# Vivado block design bd_1f3d, xcu200-fsgd2104-2-e, Vivado 2020.1
# (continued, part 4 of 5)
current_bd_instance /m09_exit_pipeline

create_bd_cell -type ip -vlnv xilinx.com:ip:sc_exit:1.0 m09_exit
set_property -dict [list \
  CONFIG.ADDR_WIDTH 9 \
  CONFIG.ENABLE_PIPELINING 0 \
  CONFIG.HAS_BURST 0 \
  CONFIG.IS_CASCADED 0 \
  CONFIG.MEP_IDENTIFIER_WIDTH 1 \
  CONFIG.M_MAX_BURST_LENGTH 0 \
  CONFIG.M_PROTOCOL AXI4LITE \
  CONFIG.NUM_MSC 11 \
  CONFIG.NUM_READ_OUTSTANDING 1 \
  CONFIG.NUM_WRITE_OUTSTANDING 1 \
  CONFIG.RDATA_WIDTH 32 \
  CONFIG.READ_WRITE_MODE READ_WRITE \
  CONFIG.SINGLE_ISSUING 1 \
  CONFIG.SSC000_ROUTE 0b111 \
  CONFIG.SSC001_ROUTE 0b101 \
  CONFIG.SSC_ROUTE_WIDTH 3 \
  CONFIG.S_ID_WIDTH 1 \
  CONFIG.WDATA_WIDTH 32 \
] [get_bd_cells m09_exit]

# ---- hierarchy /m10_nodes ----
current_bd_instance /m10_nodes
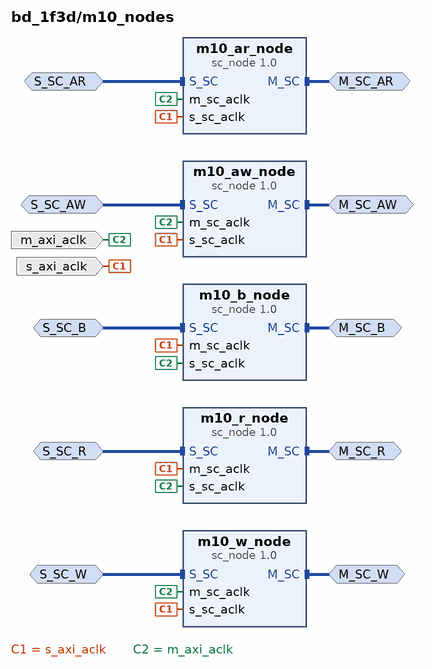
[diagram p25: block diagram inside /m10_nodes]
create_bd_intf_pin -mode Master -vlnv xilinx.com:interface:sc_rtl:1.0 M_SC_AR
create_bd_intf_pin -mode Slave -vlnv xilinx.com:interface:sc_rtl:1.0 S_SC_AR
create_bd_intf_pin -mode Master -vlnv xilinx.com:interface:sc_rtl:1.0 M_SC_R
create_bd_intf_pin -mode Slave -vlnv xilinx.com:interface:sc_rtl:1.0 S_SC_R
create_bd_intf_pin -mode Master -vlnv xilinx.com:interface:sc_rtl:1.0 M_SC_AW
create_bd_intf_pin -mode Slave -vlnv xilinx.com:interface:sc_rtl:1.0 S_SC_AW
create_bd_intf_pin -mode Master -vlnv xilinx.com:interface:sc_rtl:1.0 M_SC_W
create_bd_intf_pin -mode Slave -vlnv xilinx.com:interface:sc_rtl:1.0 S_SC_W
create_bd_intf_pin -mode Master -vlnv xilinx.com:interface:sc_rtl:1.0 M_SC_B
create_bd_intf_pin -mode Slave -vlnv xilinx.com:interface:sc_rtl:1.0 S_SC_B
create_bd_pin -dir I -type clk s_axi_aclk
create_bd_pin -dir I -type clk m_axi_aclk

create_bd_cell -type ip -vlnv xilinx.com:ip:sc_node:1.0 m10_ar_node
set_property -dict [list \
  CONFIG.ACLK_RELATIONSHIP 0 \
  CONFIG.ADDR_WIDTH 32 \
  CONFIG.CHANNEL 2 \
  CONFIG.FIFO_SIZE 0 \
  CONFIG.FIFO_TYPE 0 \
  CONFIG.ID_WIDTH 1 \
  CONFIG.M00_NUM_BYTES 4 \
  CONFIG.M01_NUM_BYTES 4 \
  CONFIG.M02_NUM_BYTES 4 \
  CONFIG.M03_NUM_BYTES 4 \
  CONFIG.M04_NUM_BYTES 4 \
  CONFIG.M05_NUM_BYTES 4 \
  CONFIG.M06_NUM_BYTES 4 \
  CONFIG.M07_NUM_BYTES 4 \
  CONFIG.M08_NUM_BYTES 4 \
  CONFIG.M09_NUM_BYTES 4 \
  CONFIG.M10_NUM_BYTES 4 \
  CONFIG.M11_NUM_BYTES 4 \
  CONFIG.M12_NUM_BYTES 4 \
  CONFIG.M13_NUM_BYTES 4 \
  CONFIG.M14_NUM_BYTES 4 \
  CONFIG.M15_NUM_BYTES 4 \
  CONFIG.MAX_PAYLD_BYTES 4 \
  CONFIG.M_SEND_PIPELINE 0 \
  CONFIG.NUM_MI 1 \
  CONFIG.NUM_OUTSTANDING 1 \
  CONFIG.NUM_SI 1 \
  CONFIG.PAYLD_WIDTH 150 \
  CONFIG.S00_NUM_BYTES 4 \
  CONFIG.S01_NUM_BYTES 4 \
  CONFIG.S02_NUM_BYTES 4 \
  CONFIG.S03_NUM_BYTES 4 \
  CONFIG.S04_NUM_BYTES 4 \
  CONFIG.S05_NUM_BYTES 4 \
  CONFIG.S06_NUM_BYTES 4 \
  CONFIG.S07_NUM_BYTES 4 \
  CONFIG.S08_NUM_BYTES 4 \
  CONFIG.S09_NUM_BYTES 4 \
  CONFIG.S10_NUM_BYTES 4 \
  CONFIG.S11_NUM_BYTES 4 \
  CONFIG.S12_NUM_BYTES 4 \
  CONFIG.S13_NUM_BYTES 4 \
  CONFIG.S14_NUM_BYTES 4 \
  CONFIG.S15_NUM_BYTES 4 \
  CONFIG.SC_ROUTE_WIDTH 13 \
  CONFIG.USER_WIDTH 0 \
] [get_bd_cells m10_ar_node]
create_bd_cell -type ip -vlnv xilinx.com:ip:sc_node:1.0 m10_r_node
set_property -dict [list \
  CONFIG.ACLK_RELATIONSHIP 0 \
  CONFIG.ADDR_WIDTH 32 \
  CONFIG.CHANNEL 0 \
  CONFIG.FIFO_SIZE 0 \
  CONFIG.FIFO_TYPE 0 \
  CONFIG.ID_WIDTH 1 \
  CONFIG.M00_NUM_BYTES 4 \
  CONFIG.M01_NUM_BYTES 4 \
  CONFIG.M02_NUM_BYTES 4 \
  CONFIG.M03_NUM_BYTES 4 \
  CONFIG.M04_NUM_BYTES 4 \
  CONFIG.M05_NUM_BYTES 4 \
  CONFIG.M06_NUM_BYTES 4 \
  CONFIG.M07_NUM_BYTES 4 \
  CONFIG.M08_NUM_BYTES 4 \
  CONFIG.M09_NUM_BYTES 4 \
  CONFIG.M10_NUM_BYTES 4 \
  CONFIG.M11_NUM_BYTES 4 \
  CONFIG.M12_NUM_BYTES 4 \
  CONFIG.M13_NUM_BYTES 4 \
  CONFIG.M14_NUM_BYTES 4 \
  CONFIG.M15_NUM_BYTES 4 \
  CONFIG.MAX_PAYLD_BYTES 4 \
  CONFIG.NUM_MI 1 \
  CONFIG.NUM_OUTSTANDING 1 \
  CONFIG.NUM_SI 1 \
  CONFIG.PAYLD_WIDTH 53 \
  CONFIG.S00_NUM_BYTES 4 \
  CONFIG.S01_NUM_BYTES 4 \
  CONFIG.S02_NUM_BYTES 4 \
  CONFIG.S03_NUM_BYTES 4 \
  CONFIG.S04_NUM_BYTES 4 \
  CONFIG.S05_NUM_BYTES 4 \
  CONFIG.S06_NUM_BYTES 4 \
  CONFIG.S07_NUM_BYTES 4 \
  CONFIG.S08_NUM_BYTES 4 \
  CONFIG.S09_NUM_BYTES 4 \
  CONFIG.S10_NUM_BYTES 4 \
  CONFIG.S11_NUM_BYTES 4 \
  CONFIG.S12_NUM_BYTES 4 \
  CONFIG.S13_NUM_BYTES 4 \
  CONFIG.S14_NUM_BYTES 4 \
  CONFIG.S15_NUM_BYTES 4 \
  CONFIG.SC_ROUTE_WIDTH 3 \
  CONFIG.USER_BITS_PER_BYTE 0 \
  CONFIG.USER_WIDTH 0 \
] [get_bd_cells m10_r_node]
create_bd_cell -type ip -vlnv xilinx.com:ip:sc_node:1.0 m10_aw_node
set_property -dict [list \
  CONFIG.ACLK_RELATIONSHIP 0 \
  CONFIG.ADDR_WIDTH 32 \
  CONFIG.CHANNEL 3 \
  CONFIG.FIFO_SIZE 0 \
  CONFIG.FIFO_TYPE 0 \
  CONFIG.ID_WIDTH 1 \
  CONFIG.M00_NUM_BYTES 4 \
  CONFIG.M01_NUM_BYTES 4 \
  CONFIG.M02_NUM_BYTES 4 \
  CONFIG.M03_NUM_BYTES 4 \
  CONFIG.M04_NUM_BYTES 4 \
  CONFIG.M05_NUM_BYTES 4 \
  CONFIG.M06_NUM_BYTES 4 \
  CONFIG.M07_NUM_BYTES 4 \
  CONFIG.M08_NUM_BYTES 4 \
  CONFIG.M09_NUM_BYTES 4 \
  CONFIG.M10_NUM_BYTES 4 \
  CONFIG.M11_NUM_BYTES 4 \
  CONFIG.M12_NUM_BYTES 4 \
  CONFIG.M13_NUM_BYTES 4 \
  CONFIG.M14_NUM_BYTES 4 \
  CONFIG.M15_NUM_BYTES 4 \
  CONFIG.MAX_PAYLD_BYTES 4 \
  CONFIG.M_SEND_PIPELINE 0 \
  CONFIG.NUM_MI 1 \
  CONFIG.NUM_OUTSTANDING 1 \
  CONFIG.NUM_SI 1 \
  CONFIG.PAYLD_WIDTH 150 \
  CONFIG.S00_NUM_BYTES 4 \
  CONFIG.S01_NUM_BYTES 4 \
  CONFIG.S02_NUM_BYTES 4 \
  CONFIG.S03_NUM_BYTES 4 \
  CONFIG.S04_NUM_BYTES 4 \
  CONFIG.S05_NUM_BYTES 4 \
  CONFIG.S06_NUM_BYTES 4 \
  CONFIG.S07_NUM_BYTES 4 \
  CONFIG.S08_NUM_BYTES 4 \
  CONFIG.S09_NUM_BYTES 4 \
  CONFIG.S10_NUM_BYTES 4 \
  CONFIG.S11_NUM_BYTES 4 \
  CONFIG.S12_NUM_BYTES 4 \
  CONFIG.S13_NUM_BYTES 4 \
  CONFIG.S14_NUM_BYTES 4 \
  CONFIG.S15_NUM_BYTES 4 \
  CONFIG.SC_ROUTE_WIDTH 13 \
  CONFIG.USER_WIDTH 0 \
] [get_bd_cells m10_aw_node]
create_bd_cell -type ip -vlnv xilinx.com:ip:sc_node:1.0 m10_w_node
set_property -dict [list \
  CONFIG.ACLK_RELATIONSHIP 0 \
  CONFIG.ADDR_WIDTH 32 \
  CONFIG.CHANNEL 1 \
  CONFIG.FIFO_SIZE 0 \
  CONFIG.FIFO_TYPE 0 \
  CONFIG.ID_WIDTH 1 \
  CONFIG.M00_NUM_BYTES 4 \
  CONFIG.M01_NUM_BYTES 4 \
  CONFIG.M02_NUM_BYTES 4 \
  CONFIG.M03_NUM_BYTES 4 \
  CONFIG.M04_NUM_BYTES 4 \
  CONFIG.M05_NUM_BYTES 4 \
  CONFIG.M06_NUM_BYTES 4 \
  CONFIG.M07_NUM_BYTES 4 \
  CONFIG.M08_NUM_BYTES 4 \
  CONFIG.M09_NUM_BYTES 4 \
  CONFIG.M10_NUM_BYTES 4 \
  CONFIG.M11_NUM_BYTES 4 \
  CONFIG.M12_NUM_BYTES 4 \
  CONFIG.M13_NUM_BYTES 4 \
  CONFIG.M14_NUM_BYTES 4 \
  CONFIG.M15_NUM_BYTES 4 \
  CONFIG.MAX_PAYLD_BYTES 4 \
  CONFIG.M_SEND_PIPELINE 0 \
  CONFIG.NUM_MI 1 \
  CONFIG.NUM_OUTSTANDING 1 \
  CONFIG.NUM_SI 1 \
  CONFIG.PAYLD_WIDTH 64 \
  CONFIG.S00_NUM_BYTES 4 \
  CONFIG.S01_NUM_BYTES 4 \
  CONFIG.S02_NUM_BYTES 4 \
  CONFIG.S03_NUM_BYTES 4 \
  CONFIG.S04_NUM_BYTES 4 \
  CONFIG.S05_NUM_BYTES 4 \
  CONFIG.S06_NUM_BYTES 4 \
  CONFIG.S07_NUM_BYTES 4 \
  CONFIG.S08_NUM_BYTES 4 \
  CONFIG.S09_NUM_BYTES 4 \
  CONFIG.S10_NUM_BYTES 4 \
  CONFIG.S11_NUM_BYTES 4 \
  CONFIG.S12_NUM_BYTES 4 \
  CONFIG.S13_NUM_BYTES 4 \
  CONFIG.S14_NUM_BYTES 4 \
  CONFIG.S15_NUM_BYTES 4 \
  CONFIG.SC_ROUTE_WIDTH 13 \
  CONFIG.USER_BITS_PER_BYTE 0 \
  CONFIG.USER_WIDTH 0 \
] [get_bd_cells m10_w_node]
create_bd_cell -type ip -vlnv xilinx.com:ip:sc_node:1.0 m10_b_node
set_property -dict [list \
  CONFIG.ACLK_RELATIONSHIP 0 \
  CONFIG.ADDR_WIDTH 32 \
  CONFIG.CHANNEL 4 \
  CONFIG.FIFO_SIZE 0 \
  CONFIG.FIFO_TYPE 0 \
  CONFIG.ID_WIDTH 1 \
  CONFIG.M00_NUM_BYTES 4 \
  CONFIG.M01_NUM_BYTES 4 \
  CONFIG.M02_NUM_BYTES 4 \
  CONFIG.M03_NUM_BYTES 4 \
  CONFIG.M04_NUM_BYTES 4 \
  CONFIG.M05_NUM_BYTES 4 \
  CONFIG.M06_NUM_BYTES 4 \
  CONFIG.M07_NUM_BYTES 4 \
  CONFIG.M08_NUM_BYTES 4 \
  CONFIG.M09_NUM_BYTES 4 \
  CONFIG.M10_NUM_BYTES 4 \
  CONFIG.M11_NUM_BYTES 4 \
  CONFIG.M12_NUM_BYTES 4 \
  CONFIG.M13_NUM_BYTES 4 \
  CONFIG.M14_NUM_BYTES 4 \
  CONFIG.M15_NUM_BYTES 4 \
  CONFIG.MAX_PAYLD_BYTES 4 \
  CONFIG.NUM_MI 1 \
  CONFIG.NUM_OUTSTANDING 1 \
  CONFIG.NUM_SI 1 \
  CONFIG.PAYLD_WIDTH 7 \
  CONFIG.S00_NUM_BYTES 4 \
  CONFIG.S01_NUM_BYTES 4 \
  CONFIG.S02_NUM_BYTES 4 \
  CONFIG.S03_NUM_BYTES 4 \
  CONFIG.S04_NUM_BYTES 4 \
  CONFIG.S05_NUM_BYTES 4 \
  CONFIG.S06_NUM_BYTES 4 \
  CONFIG.S07_NUM_BYTES 4 \
  CONFIG.S08_NUM_BYTES 4 \
  CONFIG.S09_NUM_BYTES 4 \
  CONFIG.S10_NUM_BYTES 4 \
  CONFIG.S11_NUM_BYTES 4 \
  CONFIG.S12_NUM_BYTES 4 \
  CONFIG.S13_NUM_BYTES 4 \
  CONFIG.S14_NUM_BYTES 4 \
  CONFIG.S15_NUM_BYTES 4 \
  CONFIG.SC_ROUTE_WIDTH 3 \
  CONFIG.USER_WIDTH 0 \
] [get_bd_cells m10_b_node]

# ---- hierarchy /m10_exit_pipeline ----
current_bd_instance /m10_exit_pipeline
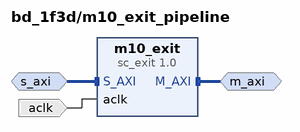
[diagram p26: block diagram inside /m10_exit_pipeline]
create_bd_intf_pin -mode Slave -vlnv xilinx.com:interface:aximm_rtl:1.0 s_axi
create_bd_intf_pin -mode Master -vlnv xilinx.com:interface:aximm_rtl:1.0 m_axi
create_bd_pin -dir I -type clk aclk

create_bd_cell -type ip -vlnv xilinx.com:ip:sc_exit:1.0 m10_exit
set_property -dict [list \
  CONFIG.ADDR_WIDTH 9 \
  CONFIG.ENABLE_PIPELINING 0 \
  CONFIG.HAS_BURST 0 \
  CONFIG.IS_CASCADED 0 \
  CONFIG.MEP_IDENTIFIER_WIDTH 1 \
  CONFIG.M_MAX_BURST_LENGTH 0 \
  CONFIG.M_PROTOCOL AXI4LITE \
  CONFIG.NUM_MSC 11 \
  CONFIG.NUM_READ_OUTSTANDING 1 \
  CONFIG.NUM_WRITE_OUTSTANDING 1 \
  CONFIG.RDATA_WIDTH 32 \
  CONFIG.READ_WRITE_MODE READ_WRITE \
  CONFIG.SINGLE_ISSUING 1 \
  CONFIG.SSC000_ROUTE 0b111 \
  CONFIG.SSC001_ROUTE 0b101 \
  CONFIG.SSC_ROUTE_WIDTH 3 \
  CONFIG.S_ID_WIDTH 1 \
  CONFIG.WDATA_WIDTH 32 \
] [get_bd_cells m10_exit]

# ---- connections ----

current_bd_instance /clk_map
connect_bd_net -net clk_map_aclk1_net [get_bd_pins aclk1] \
  [get_bd_pins M01_ACLK] [get_bd_pins M02_ACLK] [get_bd_pins M03_ACLK] [get_bd_pins M04_ACLK] [get_bd_pins M05_ACLK] \
  [get_bd_pins M06_ACLK] [get_bd_pins M07_ACLK] [get_bd_pins M08_ACLK] [get_bd_pins M09_ACLK] [get_bd_pins M10_ACLK]
connect_bd_net -net clk_map_aclk_net [get_bd_pins aclk] [get_bd_pins S00_ACLK] [get_bd_pins M00_ACLK] [get_bd_pins swbd_aclk]

current_bd_instance /switchboards
connect_bd_intf_net [get_bd_intf_pins M00_SC_AW] [get_bd_intf_pins aw_la_out_swbd/M00_SC]
connect_bd_intf_net [get_bd_intf_pins S00_SC_AW] [get_bd_intf_pins aw_la_in_swbd/S00_SC]
connect_bd_intf_net [get_bd_intf_pins S00_SC_AR] [get_bd_intf_pins ar_la_in_swbd/S00_SC]
connect_bd_intf_net [get_bd_intf_pins M00_SC_B] [get_bd_intf_pins b_la_in_swbd/M00_SC]
connect_bd_intf_net [get_bd_intf_pins M00_SC_R] [get_bd_intf_pins r_la_in_swbd/M00_SC]
connect_bd_intf_net [get_bd_intf_pins M00_SC_AR] [get_bd_intf_pins ar_la_out_swbd/M00_SC]
connect_bd_intf_net [get_bd_intf_pins S00_SC_W] [get_bd_intf_pins w_la_in_swbd/S00_SC]
connect_bd_intf_net [get_bd_intf_pins S03_SC_R] [get_bd_intf_pins r_la_out_swbd/S03_SC]
connect_bd_intf_net [get_bd_intf_pins S02_SC_R] [get_bd_intf_pins r_la_out_swbd/S02_SC]
connect_bd_intf_net [get_bd_intf_pins S06_SC_B] [get_bd_intf_pins b_la_out_swbd/S06_SC]
connect_bd_intf_net [get_bd_intf_pins S10_SC_B] [get_bd_intf_pins b_la_out_swbd/S10_SC]
connect_bd_intf_net [get_bd_intf_pins S09_SC_B] [get_bd_intf_pins b_la_out_swbd/S09_SC]
connect_bd_intf_net [get_bd_intf_pins S08_SC_B] [get_bd_intf_pins b_la_out_swbd/S08_SC]
connect_bd_intf_net [get_bd_intf_pins S07_SC_B] [get_bd_intf_pins b_la_out_swbd/S07_SC]
connect_bd_intf_net [get_bd_intf_pins M07_SC_AW] [get_bd_intf_pins aw_la_out_swbd/M07_SC]
connect_bd_intf_net [get_bd_intf_pins M05_SC_AW] [get_bd_intf_pins aw_la_out_swbd/M05_SC]
connect_bd_intf_net [get_bd_intf_pins M06_SC_AW] [get_bd_intf_pins aw_la_out_swbd/M06_SC]
connect_bd_intf_net [get_bd_intf_pins M04_SC_AW] [get_bd_intf_pins aw_la_out_swbd/M04_SC]
connect_bd_intf_net [get_bd_intf_pins M03_SC_AW] [get_bd_intf_pins aw_la_out_swbd/M03_SC]
connect_bd_intf_net [get_bd_intf_pins S05_SC_B] [get_bd_intf_pins b_la_out_swbd/S05_SC]
connect_bd_intf_net [get_bd_intf_pins S04_SC_B] [get_bd_intf_pins b_la_out_swbd/S04_SC]
connect_bd_intf_net [get_bd_intf_pins S03_SC_B] [get_bd_intf_pins b_la_out_swbd/S03_SC]
connect_bd_intf_net [get_bd_intf_pins S02_SC_B] [get_bd_intf_pins b_la_out_swbd/S02_SC]
connect_bd_intf_net [get_bd_intf_pins S01_SC_B] [get_bd_intf_pins b_la_out_swbd/S01_SC]
connect_bd_intf_net [get_bd_intf_pins S00_SC_B] [get_bd_intf_pins b_la_out_swbd/S00_SC]
connect_bd_intf_net [get_bd_intf_pins M10_SC_AW] [get_bd_intf_pins aw_la_out_swbd/M10_SC]
connect_bd_intf_net [get_bd_intf_pins M09_SC_AW] [get_bd_intf_pins aw_la_out_swbd/M09_SC]
connect_bd_intf_net [get_bd_intf_pins M08_SC_AW] [get_bd_intf_pins aw_la_out_swbd/M08_SC]
connect_bd_intf_net [get_bd_intf_pins M10_SC_AR] [get_bd_intf_pins ar_la_out_swbd/M10_SC]
connect_bd_intf_net [get_bd_intf_pins M09_SC_AR] [get_bd_intf_pins ar_la_out_swbd/M09_SC]
connect_bd_intf_net [get_bd_intf_pins M08_SC_AR] [get_bd_intf_pins ar_la_out_swbd/M08_SC]
connect_bd_intf_net [get_bd_intf_pins M07_SC_AR] [get_bd_intf_pins ar_la_out_swbd/M07_SC]
connect_bd_intf_net [get_bd_intf_pins M06_SC_AR] [get_bd_intf_pins ar_la_out_swbd/M06_SC]
connect_bd_intf_net [get_bd_intf_pins M05_SC_AR] [get_bd_intf_pins ar_la_out_swbd/M05_SC]
connect_bd_intf_net [get_bd_intf_pins M04_SC_AR] [get_bd_intf_pins ar_la_out_swbd/M04_SC]
connect_bd_intf_net [get_bd_intf_pins M03_SC_AR] [get_bd_intf_pins ar_la_out_swbd/M03_SC]
connect_bd_intf_net [get_bd_intf_pins M02_SC_AR] [get_bd_intf_pins ar_la_out_swbd/M02_SC]
connect_bd_intf_net [get_bd_intf_pins M02_SC_AW] [get_bd_intf_pins aw_la_out_swbd/M02_SC]
connect_bd_intf_net [get_bd_intf_pins M01_SC_AW] [get_bd_intf_pins aw_la_out_swbd/M01_SC]
connect_bd_intf_net [get_bd_intf_pins M01_SC_AR] [get_bd_intf_pins ar_la_out_swbd/M01_SC]
connect_bd_intf_net [get_bd_intf_pins r_la_in_swbd/S00_SC] [get_bd_intf_pins i_nodes/M_SC_R]
connect_bd_intf_net [get_bd_intf_pins ar_la_out_swbd/S00_SC] [get_bd_intf_pins i_nodes/M_SC_AR]
connect_bd_intf_net [get_bd_intf_pins b_la_in_swbd/S00_SC] [get_bd_intf_pins i_nodes/M_SC_B]
connect_bd_intf_net [get_bd_intf_pins aw_la_in_swbd/M00_SC] [get_bd_intf_pins i_nodes/S_SC_AW]
connect_bd_intf_net [get_bd_intf_pins w_la_in_swbd/M00_SC] [get_bd_intf_pins i_nodes/S_SC_W]
connect_bd_intf_net [get_bd_intf_pins ar_la_in_swbd/M00_SC] [get_bd_intf_pins i_nodes/S_SC_AR]
connect_bd_intf_net [get_bd_intf_pins M10_SC_W] [get_bd_intf_pins w_la_out_swbd/M10_SC]
connect_bd_intf_net [get_bd_intf_pins b_la_out_swbd/M00_SC] [get_bd_intf_pins i_nodes/S_SC_B]
connect_bd_intf_net [get_bd_intf_pins r_la_out_swbd/M00_SC] [get_bd_intf_pins i_nodes/S_SC_R]
connect_bd_intf_net [get_bd_intf_pins w_la_out_swbd/S00_SC] [get_bd_intf_pins i_nodes/M_SC_W]
connect_bd_intf_net [get_bd_intf_pins aw_la_out_swbd/S00_SC] [get_bd_intf_pins i_nodes/M_SC_AW]
connect_bd_intf_net [get_bd_intf_pins M05_SC_W] [get_bd_intf_pins w_la_out_swbd/M05_SC]
connect_bd_intf_net [get_bd_intf_pins M06_SC_W] [get_bd_intf_pins w_la_out_swbd/M06_SC]
connect_bd_intf_net [get_bd_intf_pins M04_SC_W] [get_bd_intf_pins w_la_out_swbd/M04_SC]
connect_bd_intf_net [get_bd_intf_pins M03_SC_W] [get_bd_intf_pins w_la_out_swbd/M03_SC]
connect_bd_intf_net [get_bd_intf_pins M09_SC_W] [get_bd_intf_pins w_la_out_swbd/M09_SC]
connect_bd_intf_net [get_bd_intf_pins M08_SC_W] [get_bd_intf_pins w_la_out_swbd/M08_SC]
connect_bd_intf_net [get_bd_intf_pins M07_SC_W] [get_bd_intf_pins w_la_out_swbd/M07_SC]
connect_bd_intf_net [get_bd_intf_pins S09_SC_R] [get_bd_intf_pins r_la_out_swbd/S09_SC]
connect_bd_intf_net [get_bd_intf_pins S07_SC_R] [get_bd_intf_pins r_la_out_swbd/S07_SC]
connect_bd_intf_net [get_bd_intf_pins S08_SC_R] [get_bd_intf_pins r_la_out_swbd/S08_SC]
connect_bd_intf_net [get_bd_intf_pins M02_SC_W] [get_bd_intf_pins w_la_out_swbd/M02_SC]
connect_bd_intf_net [get_bd_intf_pins M01_SC_W] [get_bd_intf_pins w_la_out_swbd/M01_SC]
connect_bd_intf_net [get_bd_intf_pins M00_SC_W] [get_bd_intf_pins w_la_out_swbd/M00_SC]
connect_bd_intf_net [get_bd_intf_pins S10_SC_R] [get_bd_intf_pins r_la_out_swbd/S10_SC]
connect_bd_intf_net [get_bd_intf_pins S01_SC_R] [get_bd_intf_pins r_la_out_swbd/S01_SC]
connect_bd_intf_net [get_bd_intf_pins S00_SC_R] [get_bd_intf_pins r_la_out_swbd/S00_SC]
connect_bd_intf_net [get_bd_intf_pins S06_SC_R] [get_bd_intf_pins r_la_out_swbd/S06_SC]
connect_bd_intf_net [get_bd_intf_pins S05_SC_R] [get_bd_intf_pins r_la_out_swbd/S05_SC]
connect_bd_intf_net [get_bd_intf_pins S04_SC_R] [get_bd_intf_pins r_la_out_swbd/S04_SC]
connect_bd_net [get_bd_pins s_sc_aclk] \
  [get_bd_pins i_nodes/s_sc_aclk] [get_bd_pins ar_la_in_swbd/aclk] [get_bd_pins aw_la_in_swbd/aclk] \
  [get_bd_pins b_la_in_swbd/aclk] [get_bd_pins r_la_in_swbd/aclk] [get_bd_pins w_la_in_swbd/aclk]
connect_bd_net [get_bd_pins m_sc_aclk] \
  [get_bd_pins i_nodes/m_sc_aclk] [get_bd_pins ar_la_out_swbd/aclk] [get_bd_pins aw_la_out_swbd/aclk] \
  [get_bd_pins b_la_out_swbd/aclk] [get_bd_pins r_la_out_swbd/aclk] [get_bd_pins w_la_out_swbd/aclk]

current_bd_instance /switchboards/i_nodes
connect_bd_intf_net [get_bd_intf_pins S_SC_R] [get_bd_intf_pins i_r_node/S_SC]
connect_bd_intf_net [get_bd_intf_pins M_SC_AW] [get_bd_intf_pins i_aw_node/M_SC]
connect_bd_intf_net [get_bd_intf_pins S_SC_AW] [get_bd_intf_pins i_aw_node/S_SC]
connect_bd_intf_net [get_bd_intf_pins M_SC_W] [get_bd_intf_pins i_w_node/M_SC]
connect_bd_intf_net [get_bd_intf_pins S_SC_W] [get_bd_intf_pins i_w_node/S_SC]
connect_bd_intf_net [get_bd_intf_pins M_SC_B] [get_bd_intf_pins i_b_node/M_SC]
connect_bd_intf_net [get_bd_intf_pins S_SC_B] [get_bd_intf_pins i_b_node/S_SC]
connect_bd_intf_net [get_bd_intf_pins M_SC_R] [get_bd_intf_pins i_r_node/M_SC]
connect_bd_intf_net [get_bd_intf_pins M_SC_AR] [get_bd_intf_pins i_ar_node/M_SC]
connect_bd_intf_net [get_bd_intf_pins S_SC_AR] [get_bd_intf_pins i_ar_node/S_SC]
connect_bd_net [get_bd_pins s_sc_aclk] \
  [get_bd_pins i_aw_node/s_sc_aclk] [get_bd_pins i_w_node/s_sc_aclk] [get_bd_pins i_ar_node/s_sc_aclk] \
  [get_bd_pins i_r_node/m_sc_aclk] [get_bd_pins i_b_node/m_sc_aclk]
connect_bd_net [get_bd_pins m_sc_aclk] \
  [get_bd_pins i_aw_node/m_sc_aclk] [get_bd_pins i_ar_node/m_sc_aclk] [get_bd_pins i_w_node/m_sc_aclk] \
  [get_bd_pins i_r_node/s_sc_aclk] [get_bd_pins i_b_node/s_sc_aclk]

current_bd_instance /s00_entry_pipeline
connect_bd_intf_net [get_bd_intf_pins m_axi] [get_bd_intf_pins s00_si_converter/M_AXI]
connect_bd_intf_net [get_bd_intf_pins s00_transaction_regulator/M_AXI] [get_bd_intf_pins s00_si_converter/S_AXI]
connect_bd_intf_net [get_bd_intf_pins s00_mmu/M_AXI] [get_bd_intf_pins s00_transaction_regulator/S_AXI]
connect_bd_intf_net [get_bd_intf_pins s_axi] [get_bd_intf_pins s00_mmu/S_AXI]
connect_bd_net [get_bd_pins aclk] [get_bd_pins s00_mmu/aclk] [get_bd_pins s00_si_converter/aclk] [get_bd_pins s00_transaction_regulator/aclk]

current_bd_instance /s00_nodes
connect_bd_intf_net [get_bd_intf_pins M_SC_AW] [get_bd_intf_pins s00_aw_node/M_SC]
connect_bd_intf_net [get_bd_intf_pins S_SC_R] [get_bd_intf_pins s00_r_node/S_SC]
connect_bd_intf_net [get_bd_intf_pins M_SC_R] [get_bd_intf_pins s00_r_node/M_SC]
connect_bd_intf_net [get_bd_intf_pins M_SC_AR] [get_bd_intf_pins s00_ar_node/M_SC]
connect_bd_intf_net [get_bd_intf_pins S_SC_AR] [get_bd_intf_pins s00_ar_node/S_SC]
connect_bd_intf_net [get_bd_intf_pins S_SC_B] [get_bd_intf_pins s00_b_node/S_SC]
connect_bd_intf_net [get_bd_intf_pins M_SC_B] [get_bd_intf_pins s00_b_node/M_SC]
connect_bd_intf_net [get_bd_intf_pins S_SC_W] [get_bd_intf_pins s00_w_node/S_SC]
connect_bd_intf_net [get_bd_intf_pins M_SC_W] [get_bd_intf_pins s00_w_node/M_SC]
connect_bd_intf_net [get_bd_intf_pins S_SC_AW] [get_bd_intf_pins s00_aw_node/S_SC]
connect_bd_net [get_bd_pins s_sc_clk] \
  [get_bd_pins s00_ar_node/s_sc_aclk] [get_bd_pins s00_aw_node/s_sc_aclk] [get_bd_pins s00_w_node/s_sc_aclk] \
  [get_bd_pins s00_r_node/m_sc_aclk] [get_bd_pins s00_b_node/m_sc_aclk]
connect_bd_net [get_bd_pins m_sc_clk] \
  [get_bd_pins s00_ar_node/m_sc_aclk] [get_bd_pins s00_aw_node/m_sc_aclk] [get_bd_pins s00_w_node/m_sc_aclk] \
  [get_bd_pins s00_r_node/s_sc_aclk] [get_bd_pins s00_b_node/s_sc_aclk]

current_bd_instance /m00_nodes
connect_bd_intf_net [get_bd_intf_pins S_SC_B] [get_bd_intf_pins m00_b_node/S_SC]
connect_bd_intf_net [get_bd_intf_pins M_SC_B] [get_bd_intf_pins m00_b_node/M_SC]
connect_bd_intf_net [get_bd_intf_pins S_SC_W] [get_bd_intf_pins m00_w_node/S_SC]
connect_bd_intf_net [get_bd_intf_pins M_SC_W] [get_bd_intf_pins m00_w_node/M_SC]
connect_bd_intf_net [get_bd_intf_pins S_SC_AW] [get_bd_intf_pins m00_aw_node/S_SC]
connect_bd_intf_net [get_bd_intf_pins M_SC_AW] [get_bd_intf_pins m00_aw_node/M_SC]
connect_bd_intf_net [get_bd_intf_pins S_SC_R] [get_bd_intf_pins m00_r_node/S_SC]
connect_bd_intf_net [get_bd_intf_pins M_SC_R] [get_bd_intf_pins m00_r_node/M_SC]
connect_bd_intf_net [get_bd_intf_pins M_SC_AR] [get_bd_intf_pins m00_ar_node/M_SC]
connect_bd_intf_net [get_bd_intf_pins S_SC_AR] [get_bd_intf_pins m00_ar_node/S_SC]
connect_bd_net [get_bd_pins s_axi_aclk] \
  [get_bd_pins m00_ar_node/s_sc_aclk] [get_bd_pins m00_aw_node/s_sc_aclk] [get_bd_pins m00_w_node/s_sc_aclk] \
  [get_bd_pins m00_r_node/m_sc_aclk] [get_bd_pins m00_b_node/m_sc_aclk]
connect_bd_net [get_bd_pins m_axi_aclk] \
  [get_bd_pins m00_ar_node/m_sc_aclk] [get_bd_pins m00_aw_node/m_sc_aclk] [get_bd_pins m00_w_node/m_sc_aclk] \
  [get_bd_pins m00_r_node/s_sc_aclk] [get_bd_pins m00_b_node/s_sc_aclk]

current_bd_instance /m00_exit_pipeline
connect_bd_intf_net [get_bd_intf_pins m_axi] [get_bd_intf_pins m00_exit/M_AXI]
connect_bd_intf_net [get_bd_intf_pins s_axi] [get_bd_intf_pins m00_exit/S_AXI]
connect_bd_net [get_bd_pins aclk] [get_bd_pins m00_exit/aclk]

current_bd_instance /m01_nodes
connect_bd_intf_net [get_bd_intf_pins M_SC_R] [get_bd_intf_pins m01_r_node/M_SC]
connect_bd_intf_net [get_bd_intf_pins S_SC_W] [get_bd_intf_pins m01_w_node/S_SC]
connect_bd_intf_net [get_bd_intf_pins M_SC_B] [get_bd_intf_pins m01_b_node/M_SC]
connect_bd_intf_net [get_bd_intf_pins S_SC_B] [get_bd_intf_pins m01_b_node/S_SC]
connect_bd_intf_net [get_bd_intf_pins S_SC_R] [get_bd_intf_pins m01_r_node/S_SC]
connect_bd_intf_net [get_bd_intf_pins M_SC_AW] [get_bd_intf_pins m01_aw_node/M_SC]
connect_bd_intf_net [get_bd_intf_pins S_SC_AW] [get_bd_intf_pins m01_aw_node/S_SC]
connect_bd_intf_net [get_bd_intf_pins M_SC_W] [get_bd_intf_pins m01_w_node/M_SC]
connect_bd_intf_net [get_bd_intf_pins S_SC_AR] [get_bd_intf_pins m01_ar_node/S_SC]
connect_bd_intf_net [get_bd_intf_pins M_SC_AR] [get_bd_intf_pins m01_ar_node/M_SC]
connect_bd_net [get_bd_pins s_axi_aclk] \
  [get_bd_pins m01_ar_node/s_sc_aclk] [get_bd_pins m01_aw_node/s_sc_aclk] [get_bd_pins m01_w_node/s_sc_aclk] \
  [get_bd_pins m01_r_node/m_sc_aclk] [get_bd_pins m01_b_node/m_sc_aclk]
connect_bd_net [get_bd_pins m_axi_aclk] \
  [get_bd_pins m01_ar_node/m_sc_aclk] [get_bd_pins m01_aw_node/m_sc_aclk] [get_bd_pins m01_w_node/m_sc_aclk] \
  [get_bd_pins m01_r_node/s_sc_aclk] [get_bd_pins m01_b_node/s_sc_aclk]

current_bd_instance /m01_exit_pipeline
connect_bd_intf_net [get_bd_intf_pins m_axi] [get_bd_intf_pins m01_exit/M_AXI]
connect_bd_intf_net [get_bd_intf_pins s_axi] [get_bd_intf_pins m01_exit/S_AXI]
connect_bd_net [get_bd_pins aclk] [get_bd_pins m01_exit/aclk]

current_bd_instance /m02_nodes
connect_bd_intf_net [get_bd_intf_pins S_SC_R] [get_bd_intf_pins m02_r_node/S_SC]
connect_bd_intf_net [get_bd_intf_pins M_SC_AW] [get_bd_intf_pins m02_aw_node/M_SC]
connect_bd_intf_net [get_bd_intf_pins M_SC_R] [get_bd_intf_pins m02_r_node/M_SC]
connect_bd_intf_net [get_bd_intf_pins S_SC_AR] [get_bd_intf_pins m02_ar_node/S_SC]
connect_bd_intf_net [get_bd_intf_pins M_SC_AR] [get_bd_intf_pins m02_ar_node/M_SC]
connect_bd_intf_net [get_bd_intf_pins S_SC_AW] [get_bd_intf_pins m02_aw_node/S_SC]
connect_bd_intf_net [get_bd_intf_pins M_SC_W] [get_bd_intf_pins m02_w_node/M_SC]
connect_bd_intf_net [get_bd_intf_pins S_SC_W] [get_bd_intf_pins m02_w_node/S_SC]
connect_bd_intf_net [get_bd_intf_pins M_SC_B] [get_bd_intf_pins m02_b_node/M_SC]
connect_bd_intf_net [get_bd_intf_pins S_SC_B] [get_bd_intf_pins m02_b_node/S_SC]
connect_bd_net [get_bd_pins s_axi_aclk] \
  [get_bd_pins m02_ar_node/s_sc_aclk] [get_bd_pins m02_aw_node/s_sc_aclk] [get_bd_pins m02_w_node/s_sc_aclk] \
  [get_bd_pins m02_r_node/m_sc_aclk] [get_bd_pins m02_b_node/m_sc_aclk]
connect_bd_net [get_bd_pins m_axi_aclk] \
  [get_bd_pins m02_ar_node/m_sc_aclk] [get_bd_pins m02_aw_node/m_sc_aclk] [get_bd_pins m02_w_node/m_sc_aclk] \
  [get_bd_pins m02_r_node/s_sc_aclk] [get_bd_pins m02_b_node/s_sc_aclk]

current_bd_instance /m02_exit_pipeline
connect_bd_intf_net [get_bd_intf_pins m_axi] [get_bd_intf_pins m02_exit/M_AXI]
connect_bd_intf_net [get_bd_intf_pins s_axi] [get_bd_intf_pins m02_exit/S_AXI]
connect_bd_net [get_bd_pins aclk] [get_bd_pins m02_exit/aclk]

current_bd_instance /m03_nodes
connect_bd_intf_net [get_bd_intf_pins M_SC_B] [get_bd_intf_pins m03_b_node/M_SC]
connect_bd_intf_net [get_bd_intf_pins S_SC_W] [get_bd_intf_pins m03_w_node/S_SC]
connect_bd_intf_net [get_bd_intf_pins S_SC_B] [get_bd_intf_pins m03_b_node/S_SC]
connect_bd_intf_net [get_bd_intf_pins M_SC_R] [get_bd_intf_pins m03_r_node/M_SC]
connect_bd_intf_net [get_bd_intf_pins M_SC_AR] [get_bd_intf_pins m03_ar_node/M_SC]
connect_bd_intf_net [get_bd_intf_pins S_SC_AR] [get_bd_intf_pins m03_ar_node/S_SC]
connect_bd_intf_net [get_bd_intf_pins M_SC_W] [get_bd_intf_pins m03_w_node/M_SC]
connect_bd_intf_net [get_bd_intf_pins S_SC_AW] [get_bd_intf_pins m03_aw_node/S_SC]
connect_bd_intf_net [get_bd_intf_pins M_SC_AW] [get_bd_intf_pins m03_aw_node/M_SC]
connect_bd_intf_net [get_bd_intf_pins S_SC_R] [get_bd_intf_pins m03_r_node/S_SC]
connect_bd_net [get_bd_pins s_axi_aclk] \
  [get_bd_pins m03_ar_node/s_sc_aclk] [get_bd_pins m03_aw_node/s_sc_aclk] [get_bd_pins m03_w_node/s_sc_aclk] \
  [get_bd_pins m03_r_node/m_sc_aclk] [get_bd_pins m03_b_node/m_sc_aclk]
connect_bd_net [get_bd_pins m_axi_aclk] \
  [get_bd_pins m03_ar_node/m_sc_aclk] [get_bd_pins m03_aw_node/m_sc_aclk] [get_bd_pins m03_w_node/m_sc_aclk] \
  [get_bd_pins m03_r_node/s_sc_aclk] [get_bd_pins m03_b_node/s_sc_aclk]

current_bd_instance /m03_exit_pipeline
connect_bd_intf_net [get_bd_intf_pins m_axi] [get_bd_intf_pins m03_exit/M_AXI]
connect_bd_intf_net [get_bd_intf_pins s_axi] [get_bd_intf_pins m03_exit/S_AXI]
connect_bd_net [get_bd_pins aclk] [get_bd_pins m03_exit/aclk]

current_bd_instance /m04_nodes
connect_bd_intf_net [get_bd_intf_pins M_SC_B] [get_bd_intf_pins m04_b_node/M_SC]
connect_bd_intf_net [get_bd_intf_pins S_SC_W] [get_bd_intf_pins m04_w_node/S_SC]
connect_bd_intf_net [get_bd_intf_pins M_SC_W] [get_bd_intf_pins m04_w_node/M_SC]
connect_bd_intf_net [get_bd_intf_pins S_SC_AW] [get_bd_intf_pins m04_aw_node/S_SC]
connect_bd_intf_net [get_bd_intf_pins M_SC_AW] [get_bd_intf_pins m04_aw_node/M_SC]
connect_bd_intf_net [get_bd_intf_pins S_SC_R] [get_bd_intf_pins m04_r_node/S_SC]
connect_bd_intf_net [get_bd_intf_pins M_SC_R] [get_bd_intf_pins m04_r_node/M_SC]
connect_bd_intf_net [get_bd_intf_pins M_SC_AR] [get_bd_intf_pins m04_ar_node/M_SC]
connect_bd_intf_net [get_bd_intf_pins S_SC_AR] [get_bd_intf_pins m04_ar_node/S_SC]
connect_bd_intf_net [get_bd_intf_pins S_SC_B] [get_bd_intf_pins m04_b_node/S_SC]
connect_bd_net [get_bd_pins s_axi_aclk] \
  [get_bd_pins m04_ar_node/s_sc_aclk] [get_bd_pins m04_aw_node/s_sc_aclk] [get_bd_pins m04_w_node/s_sc_aclk] \
  [get_bd_pins m04_r_node/m_sc_aclk] [get_bd_pins m04_b_node/m_sc_aclk]
connect_bd_net [get_bd_pins m_axi_aclk] \
  [get_bd_pins m04_ar_node/m_sc_aclk] [get_bd_pins m04_aw_node/m_sc_aclk] [get_bd_pins m04_w_node/m_sc_aclk] \
  [get_bd_pins m04_r_node/s_sc_aclk] [get_bd_pins m04_b_node/s_sc_aclk]

current_bd_instance /m04_exit_pipeline
connect_bd_intf_net [get_bd_intf_pins m_axi] [get_bd_intf_pins m04_exit/M_AXI]
connect_bd_intf_net [get_bd_intf_pins s_axi] [get_bd_intf_pins m04_exit/S_AXI]
connect_bd_net [get_bd_pins aclk] [get_bd_pins m04_exit/aclk]

current_bd_instance /m05_nodes
connect_bd_intf_net [get_bd_intf_pins M_SC_AW] [get_bd_intf_pins m05_aw_node/M_SC]
connect_bd_intf_net [get_bd_intf_pins S_SC_R] [get_bd_intf_pins m05_r_node/S_SC]
connect_bd_intf_net [get_bd_intf_pins S_SC_B] [get_bd_intf_pins m05_b_node/S_SC]
connect_bd_intf_net [get_bd_intf_pins S_SC_W] [get_bd_intf_pins m05_w_node/S_SC]
connect_bd_intf_net [get_bd_intf_pins M_SC_B] [get_bd_intf_pins m05_b_node/M_SC]
connect_bd_intf_net [get_bd_intf_pins M_SC_W] [get_bd_intf_pins m05_w_node/M_SC]
connect_bd_intf_net [get_bd_intf_pins S_SC_AW] [get_bd_intf_pins m05_aw_node/S_SC]
connect_bd_intf_net [get_bd_intf_pins S_SC_AR] [get_bd_intf_pins m05_ar_node/S_SC]
connect_bd_intf_net [get_bd_intf_pins M_SC_AR] [get_bd_intf_pins m05_ar_node/M_SC]
connect_bd_intf_net [get_bd_intf_pins M_SC_R] [get_bd_intf_pins m05_r_node/M_SC]
connect_bd_net [get_bd_pins s_axi_aclk] \
  [get_bd_pins m05_ar_node/s_sc_aclk] [get_bd_pins m05_aw_node/s_sc_aclk] [get_bd_pins m05_w_node/s_sc_aclk] \
  [get_bd_pins m05_r_node/m_sc_aclk] [get_bd_pins m05_b_node/m_sc_aclk]
connect_bd_net [get_bd_pins m_axi_aclk] \
  [get_bd_pins m05_ar_node/m_sc_aclk] [get_bd_pins m05_aw_node/m_sc_aclk] [get_bd_pins m05_w_node/m_sc_aclk] \
  [get_bd_pins m05_r_node/s_sc_aclk] [get_bd_pins m05_b_node/s_sc_aclk]

current_bd_instance /m05_exit_pipeline
connect_bd_intf_net [get_bd_intf_pins s_axi] [get_bd_intf_pins m05_exit/S_AXI]
connect_bd_intf_net [get_bd_intf_pins m_axi] [get_bd_intf_pins m05_exit/M_AXI]
connect_bd_net [get_bd_pins aclk] [get_bd_pins m05_exit/aclk]

current_bd_instance /m06_nodes
connect_bd_intf_net [get_bd_intf_pins M_SC_B] [get_bd_intf_pins m06_b_node/M_SC]
connect_bd_intf_net [get_bd_intf_pins S_SC_W] [get_bd_intf_pins m06_w_node/S_SC]
connect_bd_intf_net [get_bd_intf_pins S_SC_AW] [get_bd_intf_pins m06_aw_node/S_SC]
connect_bd_intf_net [get_bd_intf_pins M_SC_W] [get_bd_intf_pins m06_w_node/M_SC]
connect_bd_intf_net [get_bd_intf_pins S_SC_R] [get_bd_intf_pins m06_r_node/S_SC]
connect_bd_intf_net [get_bd_intf_pins M_SC_AW] [get_bd_intf_pins m06_aw_node/M_SC]
connect_bd_intf_net [get_bd_intf_pins M_SC_R] [get_bd_intf_pins m06_r_node/M_SC]
connect_bd_intf_net [get_bd_intf_pins S_SC_AR] [get_bd_intf_pins m06_ar_node/S_SC]
connect_bd_intf_net [get_bd_intf_pins M_SC_AR] [get_bd_intf_pins m06_ar_node/M_SC]
connect_bd_intf_net [get_bd_intf_pins S_SC_B] [get_bd_intf_pins m06_b_node/S_SC]
connect_bd_net [get_bd_pins s_axi_aclk] \
  [get_bd_pins m06_ar_node/s_sc_aclk] [get_bd_pins m06_aw_node/s_sc_aclk] [get_bd_pins m06_w_node/s_sc_aclk] \
  [get_bd_pins m06_r_node/m_sc_aclk] [get_bd_pins m06_b_node/m_sc_aclk]
connect_bd_net [get_bd_pins m_axi_aclk] \
  [get_bd_pins m06_ar_node/m_sc_aclk] [get_bd_pins m06_aw_node/m_sc_aclk] [get_bd_pins m06_w_node/m_sc_aclk] \
  [get_bd_pins m06_r_node/s_sc_aclk] [get_bd_pins m06_b_node/s_sc_aclk]

current_bd_instance /m06_exit_pipeline
connect_bd_intf_net [get_bd_intf_pins s_axi] [get_bd_intf_pins m06_exit/S_AXI]
connect_bd_intf_net [get_bd_intf_pins m_axi] [get_bd_intf_pins m06_exit/M_AXI]
connect_bd_net [get_bd_pins aclk] [get_bd_pins m06_exit/aclk]

current_bd_instance /m07_nodes
connect_bd_intf_net [get_bd_intf_pins S_SC_B] [get_bd_intf_pins m07_b_node/S_SC]
connect_bd_intf_net [get_bd_intf_pins M_SC_AW] [get_bd_intf_pins m07_aw_node/M_SC]
connect_bd_intf_net [get_bd_intf_pins S_SC_R] [get_bd_intf_pins m07_r_node/S_SC]
connect_bd_intf_net [get_bd_intf_pins S_SC_W] [get_bd_intf_pins m07_w_node/S_SC]
connect_bd_intf_net [get_bd_intf_pins M_SC_B] [get_bd_intf_pins m07_b_node/M_SC]
connect_bd_intf_net [get_bd_intf_pins M_SC_R] [get_bd_intf_pins m07_r_node/M_SC]
connect_bd_intf_net [get_bd_intf_pins M_SC_AR] [get_bd_intf_pins m07_ar_node/M_SC]
connect_bd_intf_net [get_bd_intf_pins S_SC_AR] [get_bd_intf_pins m07_ar_node/S_SC]
connect_bd_intf_net [get_bd_intf_pins S_SC_AW] [get_bd_intf_pins m07_aw_node/S_SC]
connect_bd_intf_net [get_bd_intf_pins M_SC_W] [get_bd_intf_pins m07_w_node/M_SC]
connect_bd_net [get_bd_pins s_axi_aclk] \
  [get_bd_pins m07_ar_node/s_sc_aclk] [get_bd_pins m07_aw_node/s_sc_aclk] [get_bd_pins m07_w_node/s_sc_aclk] \
  [get_bd_pins m07_r_node/m_sc_aclk] [get_bd_pins m07_b_node/m_sc_aclk]
connect_bd_net [get_bd_pins m_axi_aclk] \
  [get_bd_pins m07_ar_node/m_sc_aclk] [get_bd_pins m07_aw_node/m_sc_aclk] [get_bd_pins m07_w_node/m_sc_aclk] \
  [get_bd_pins m07_r_node/s_sc_aclk] [get_bd_pins m07_b_node/s_sc_aclk]

current_bd_instance /m07_exit_pipeline
connect_bd_intf_net [get_bd_intf_pins m_axi] [get_bd_intf_pins m07_exit/M_AXI]
connect_bd_intf_net [get_bd_intf_pins s_axi] [get_bd_intf_pins m07_exit/S_AXI]
connect_bd_net [get_bd_pins aclk] [get_bd_pins m07_exit/aclk]

current_bd_instance /m08_nodes
connect_bd_intf_net [get_bd_intf_pins S_SC_AR] [get_bd_intf_pins m08_ar_node/S_SC]
connect_bd_intf_net [get_bd_intf_pins M_SC_AR] [get_bd_intf_pins m08_ar_node/M_SC]
connect_bd_intf_net [get_bd_intf_pins M_SC_R] [get_bd_intf_pins m08_r_node/M_SC]
connect_bd_intf_net [get_bd_intf_pins S_SC_B] [get_bd_intf_pins m08_b_node/S_SC]
connect_bd_intf_net [get_bd_intf_pins S_SC_R] [get_bd_intf_pins m08_r_node/S_SC]
connect_bd_intf_net [get_bd_intf_pins M_SC_AW] [get_bd_intf_pins m08_aw_node/M_SC]
connect_bd_intf_net [get_bd_intf_pins S_SC_AW] [get_bd_intf_pins m08_aw_node/S_SC]
connect_bd_intf_net [get_bd_intf_pins M_SC_W] [get_bd_intf_pins m08_w_node/M_SC]
connect_bd_intf_net [get_bd_intf_pins S_SC_W] [get_bd_intf_pins m08_w_node/S_SC]
connect_bd_intf_net [get_bd_intf_pins M_SC_B] [get_bd_intf_pins m08_b_node/M_SC]
connect_bd_net [get_bd_pins s_axi_aclk] \
  [get_bd_pins m08_ar_node/s_sc_aclk] [get_bd_pins m08_aw_node/s_sc_aclk] [get_bd_pins m08_w_node/s_sc_aclk] \
  [get_bd_pins m08_r_node/m_sc_aclk] [get_bd_pins m08_b_node/m_sc_aclk]
connect_bd_net [get_bd_pins m_axi_aclk] \
  [get_bd_pins m08_ar_node/m_sc_aclk] [get_bd_pins m08_aw_node/m_sc_aclk] [get_bd_pins m08_w_node/m_sc_aclk] \
  [get_bd_pins m08_r_node/s_sc_aclk] [get_bd_pins m08_b_node/s_sc_aclk]

current_bd_instance /m08_exit_pipeline
connect_bd_intf_net [get_bd_intf_pins m_axi] [get_bd_intf_pins m08_exit/M_AXI]
connect_bd_intf_net [get_bd_intf_pins s_axi] [get_bd_intf_pins m08_exit/S_AXI]
connect_bd_net [get_bd_pins aclk] [get_bd_pins m08_exit/aclk]

current_bd_instance /m09_nodes
connect_bd_intf_net [get_bd_intf_pins S_SC_B] [get_bd_intf_pins m09_b_node/S_SC]
connect_bd_intf_net [get_bd_intf_pins S_SC_AW] [get_bd_intf_pins m09_aw_node/S_SC]
connect_bd_intf_net [get_bd_intf_pins M_SC_W] [get_bd_intf_pins m09_w_node/M_SC]
connect_bd_intf_net [get_bd_intf_pins S_SC_W] [get_bd_intf_pins m09_w_node/S_SC]
connect_bd_intf_net [get_bd_intf_pins M_SC_B] [get_bd_intf_pins m09_b_node/M_SC]
connect_bd_intf_net [get_bd_intf_pins S_SC_R] [get_bd_intf_pins m09_r_node/S_SC]
connect_bd_intf_net [get_bd_intf_pins M_SC_AW] [get_bd_intf_pins m09_aw_node/M_SC]
connect_bd_intf_net [get_bd_intf_pins S_SC_AR] [get_bd_intf_pins m09_ar_node/S_SC]
connect_bd_intf_net [get_bd_intf_pins M_SC_AR] [get_bd_intf_pins m09_ar_node/M_SC]
connect_bd_intf_net [get_bd_intf_pins M_SC_R] [get_bd_intf_pins m09_r_node/M_SC]
connect_bd_net [get_bd_pins s_axi_aclk] \
  [get_bd_pins m09_ar_node/s_sc_aclk] [get_bd_pins m09_aw_node/s_sc_aclk] [get_bd_pins m09_w_node/s_sc_aclk] \
  [get_bd_pins m09_r_node/m_sc_aclk] [get_bd_pins m09_b_node/m_sc_aclk]
connect_bd_net [get_bd_pins m_axi_aclk] \
  [get_bd_pins m09_ar_node/m_sc_aclk] [get_bd_pins m09_aw_node/m_sc_aclk] [get_bd_pins m09_w_node/m_sc_aclk] \
  [get_bd_pins m09_r_node/s_sc_aclk] [get_bd_pins m09_b_node/s_sc_aclk]

current_bd_instance /m09_exit_pipeline
connect_bd_intf_net [get_bd_intf_pins m_axi] [get_bd_intf_pins m09_exit/M_AXI]
connect_bd_intf_net [get_bd_intf_pins s_axi] [get_bd_intf_pins m09_exit/S_AXI]
connect_bd_net [get_bd_pins aclk] [get_bd_pins m09_exit/aclk]

current_bd_instance /m10_nodes
connect_bd_intf_net [get_bd_intf_pins S_SC_AW] [get_bd_intf_pins m10_aw_node/S_SC]
connect_bd_intf_net [get_bd_intf_pins M_SC_W] [get_bd_intf_pins m10_w_node/M_SC]
connect_bd_intf_net [get_bd_intf_pins S_SC_AR] [get_bd_intf_pins m10_ar_node/S_SC]
connect_bd_intf_net [get_bd_intf_pins M_SC_AR] [get_bd_intf_pins m10_ar_node/M_SC]
connect_bd_intf_net [get_bd_intf_pins M_SC_R] [get_bd_intf_pins m10_r_node/M_SC]
connect_bd_intf_net [get_bd_intf_pins S_SC_R] [get_bd_intf_pins m10_r_node/S_SC]
connect_bd_intf_net [get_bd_intf_pins M_SC_AW] [get_bd_intf_pins m10_aw_node/M_SC]
connect_bd_intf_net [get_bd_intf_pins S_SC_W] [get_bd_intf_pins m10_w_node/S_SC]
connect_bd_intf_net [get_bd_intf_pins M_SC_B] [get_bd_intf_pins m10_b_node/M_SC]
connect_bd_intf_net [get_bd_intf_pins S_SC_B] [get_bd_intf_pins m10_b_node/S_SC]
connect_bd_net [get_bd_pins s_axi_aclk] \
  [get_bd_pins m10_ar_node/s_sc_aclk] [get_bd_pins m10_aw_node/s_sc_aclk] [get_bd_pins m10_w_node/s_sc_aclk] \
  [get_bd_pins m10_r_node/m_sc_aclk] [get_bd_pins m10_b_node/m_sc_aclk]
connect_bd_net [get_bd_pins m_axi_aclk] \
  [get_bd_pins m10_ar_node/m_sc_aclk] [get_bd_pins m10_aw_node/m_sc_aclk] [get_bd_pins m10_w_node/m_sc_aclk] \
  [get_bd_pins m10_r_node/s_sc_aclk] [get_bd_pins m10_b_node/s_sc_aclk]

current_bd_instance /m10_exit_pipeline
connect_bd_intf_net [get_bd_intf_pins m_axi] [get_bd_intf_pins m10_exit/M_AXI]
connect_bd_intf_net [get_bd_intf_pins s_axi] [get_bd_intf_pins m10_exit/S_AXI]
connect_bd_net [get_bd_pins aclk] [get_bd_pins m10_exit/aclk]

current_bd_instance /
connect_bd_intf_net [get_bd_intf_pins m00_nodes/S_SC_R] [get_bd_intf_pins m00_sc2axi/M_SC_R]
connect_bd_intf_net [get_bd_intf_pins m03_nodes/M_SC_AW] [get_bd_intf_pins m03_sc2axi/S_SC_AW]
connect_bd_intf_net [get_bd_intf_pins m03_nodes/M_SC_AR] [get_bd_intf_pins m03_sc2axi/S_SC_AR]
connect_bd_intf_net [get_bd_intf_pins m03_nodes/M_SC_W] [get_bd_intf_pins m03_sc2axi/S_SC_W]
connect_bd_intf_net [get_bd_intf_pins m03_nodes/S_SC_B] [get_bd_intf_pins m03_sc2axi/M_SC_B]
connect_bd_intf_net [get_bd_intf_pins m03_nodes/S_SC_R] [get_bd_intf_pins m03_sc2axi/M_SC_R]
connect_bd_intf_net [get_bd_intf_pins m03_nodes/M_SC_R] [get_bd_intf_pins switchboards/S03_SC_R]
connect_bd_intf_net [get_bd_intf_pins m03_nodes/M_SC_B] [get_bd_intf_pins switchboards/S03_SC_B]
connect_bd_intf_net [get_bd_intf_pins m03_nodes/S_SC_W] [get_bd_intf_pins switchboards/M03_SC_W]
connect_bd_intf_net [get_bd_intf_pins m03_nodes/S_SC_AW] [get_bd_intf_pins switchboards/M03_SC_AW]
connect_bd_intf_net [get_bd_intf_pins m03_nodes/S_SC_AR] [get_bd_intf_pins switchboards/M03_SC_AR]
connect_bd_intf_net [get_bd_intf_pins m03_sc2axi/M_AXI] [get_bd_intf_pins m03_exit_pipeline/s_axi]
connect_bd_intf_net [get_bd_intf_ports M03_AXI] [get_bd_intf_pins m03_exit_pipeline/m_axi]
connect_bd_intf_net [get_bd_intf_ports M02_AXI] [get_bd_intf_pins m02_exit_pipeline/m_axi]
connect_bd_intf_net [get_bd_intf_pins m04_nodes/S_SC_B] [get_bd_intf_pins m04_sc2axi/M_SC_B]
connect_bd_intf_net [get_bd_intf_pins m04_nodes/S_SC_R] [get_bd_intf_pins m04_sc2axi/M_SC_R]
connect_bd_intf_net [get_bd_intf_pins m04_nodes/M_SC_W] [get_bd_intf_pins m04_sc2axi/S_SC_W]
connect_bd_intf_net [get_bd_intf_pins m04_nodes/M_SC_AW] [get_bd_intf_pins m04_sc2axi/S_SC_AW]
connect_bd_intf_net [get_bd_intf_pins m04_nodes/M_SC_AR] [get_bd_intf_pins m04_sc2axi/S_SC_AR]
connect_bd_intf_net [get_bd_intf_pins m04_nodes/M_SC_B] [get_bd_intf_pins switchboards/S04_SC_B]
connect_bd_intf_net [get_bd_intf_pins m04_nodes/M_SC_R] [get_bd_intf_pins switchboards/S04_SC_R]
connect_bd_intf_net [get_bd_intf_pins m04_nodes/S_SC_W] [get_bd_intf_pins switchboards/M04_SC_W]
connect_bd_intf_net [get_bd_intf_pins m04_nodes/S_SC_AW] [get_bd_intf_pins switchboards/M04_SC_AW]
connect_bd_intf_net [get_bd_intf_pins m04_nodes/S_SC_AR] [get_bd_intf_pins switchboards/M04_SC_AR]
connect_bd_intf_net [get_bd_intf_pins m04_sc2axi/M_AXI] [get_bd_intf_pins m04_exit_pipeline/s_axi]
connect_bd_intf_net [get_bd_intf_ports M04_AXI] [get_bd_intf_pins m04_exit_pipeline/m_axi]
connect_bd_intf_net [get_bd_intf_pins m01_sc2axi/M_AXI] [get_bd_intf_pins m01_exit_pipeline/s_axi]
connect_bd_intf_net [get_bd_intf_pins m01_nodes/S_SC_AW] [get_bd_intf_pins switchboards/M01_SC_AW]
connect_bd_intf_net [get_bd_intf_pins m01_nodes/M_SC_R] [get_bd_intf_pins switchboards/S01_SC_R]
connect_bd_intf_net [get_bd_intf_pins m01_nodes/M_SC_AR] [get_bd_intf_pins m01_sc2axi/S_SC_AR]
connect_bd_intf_net [get_bd_intf_pins m01_nodes/S_SC_AR] [get_bd_intf_pins switchboards/M01_SC_AR]
connect_bd_intf_net [get_bd_intf_pins m01_nodes/S_SC_W] [get_bd_intf_pins switchboards/M01_SC_W]
connect_bd_intf_net [get_bd_intf_pins m01_nodes/M_SC_W] [get_bd_intf_pins m01_sc2axi/S_SC_W]
connect_bd_intf_net [get_bd_intf_pins m01_nodes/M_SC_AW] [get_bd_intf_pins m01_sc2axi/S_SC_AW]
connect_bd_intf_net [get_bd_intf_pins m01_nodes/S_SC_B] [get_bd_intf_pins m01_sc2axi/M_SC_B]
connect_bd_intf_net [get_bd_intf_pins m01_nodes/S_SC_R] [get_bd_intf_pins m01_sc2axi/M_SC_R]
connect_bd_intf_net [get_bd_intf_pins m01_nodes/M_SC_B] [get_bd_intf_pins switchboards/S01_SC_B]
connect_bd_intf_net [get_bd_intf_ports M01_AXI] [get_bd_intf_pins m01_exit_pipeline/m_axi]
connect_bd_intf_net [get_bd_intf_pins m00_nodes/S_SC_B] [get_bd_intf_pins m00_sc2axi/M_SC_B]
connect_bd_intf_net [get_bd_intf_pins m00_nodes/M_SC_AW] [get_bd_intf_pins m00_sc2axi/S_SC_AW]
connect_bd_intf_net [get_bd_intf_pins m00_nodes/M_SC_W] [get_bd_intf_pins m00_sc2axi/S_SC_W]
connect_bd_intf_net [get_bd_intf_pins m00_nodes/M_SC_AR] [get_bd_intf_pins m00_sc2axi/S_SC_AR]
connect_bd_intf_net [get_bd_intf_ports M07_AXI] [get_bd_intf_pins m07_exit_pipeline/m_axi]
connect_bd_intf_net [get_bd_intf_pins m07_sc2axi/M_AXI] [get_bd_intf_pins m07_exit_pipeline/s_axi]
connect_bd_intf_net [get_bd_intf_pins m07_nodes/S_SC_AR] [get_bd_intf_pins switchboards/M07_SC_AR]
connect_bd_intf_net [get_bd_intf_pins m07_nodes/S_SC_AW] [get_bd_intf_pins switchboards/M07_SC_AW]
connect_bd_intf_net [get_bd_intf_pins m07_nodes/S_SC_W] [get_bd_intf_pins switchboards/M07_SC_W]
connect_bd_intf_net [get_bd_intf_pins m07_nodes/M_SC_R] [get_bd_intf_pins switchboards/S07_SC_R]
connect_bd_intf_net [get_bd_intf_pins m07_nodes/M_SC_B] [get_bd_intf_pins switchboards/S07_SC_B]
connect_bd_intf_net [get_bd_intf_pins m07_nodes/M_SC_AR] [get_bd_intf_pins m07_sc2axi/S_SC_AR]
connect_bd_intf_net [get_bd_intf_pins m07_nodes/M_SC_AW] [get_bd_intf_pins m07_sc2axi/S_SC_AW]
connect_bd_intf_net [get_bd_intf_pins m07_nodes/M_SC_W] [get_bd_intf_pins m07_sc2axi/S_SC_W]
connect_bd_intf_net [get_bd_intf_pins m07_nodes/S_SC_R] [get_bd_intf_pins m07_sc2axi/M_SC_R]
connect_bd_intf_net [get_bd_intf_pins m07_nodes/S_SC_B] [get_bd_intf_pins m07_sc2axi/M_SC_B]
connect_bd_intf_net [get_bd_intf_pins m00_nodes/M_SC_B] [get_bd_intf_pins switchboards/S00_SC_B]
connect_bd_intf_net [get_bd_intf_pins m00_nodes/M_SC_R] [get_bd_intf_pins switchboards/S00_SC_R]
connect_bd_intf_net [get_bd_intf_pins m00_nodes/S_SC_AR] [get_bd_intf_pins switchboards/M00_SC_AR]
connect_bd_intf_net [get_bd_intf_ports M00_AXI] [get_bd_intf_pins m00_exit_pipeline/m_axi]
connect_bd_intf_net [get_bd_intf_pins m00_nodes/S_SC_AW] [get_bd_intf_pins switchboards/M00_SC_AW]
connect_bd_intf_net [get_bd_intf_pins m00_nodes/S_SC_W] [get_bd_intf_pins switchboards/M00_SC_W]
connect_bd_intf_net [get_bd_intf_pins m00_sc2axi/M_AXI] [get_bd_intf_pins m00_exit_pipeline/s_axi]
connect_bd_intf_net [get_bd_intf_ports M08_AXI] [get_bd_intf_pins m08_exit_pipeline/m_axi]
connect_bd_intf_net [get_bd_intf_pins m08_sc2axi/M_AXI] [get_bd_intf_pins m08_exit_pipeline/s_axi]
connect_bd_intf_net [get_bd_intf_pins m08_nodes/S_SC_AR] [get_bd_intf_pins switchboards/M08_SC_AR]
connect_bd_intf_net [get_bd_intf_pins m08_nodes/S_SC_AW] [get_bd_intf_pins switchboards/M08_SC_AW]
connect_bd_intf_net [get_bd_intf_pins m08_nodes/S_SC_W] [get_bd_intf_pins switchboards/M08_SC_W]
connect_bd_intf_net [get_bd_intf_pins m08_nodes/M_SC_R] [get_bd_intf_pins switchboards/S08_SC_R]
connect_bd_intf_net [get_bd_intf_pins m08_nodes/M_SC_B] [get_bd_intf_pins switchboards/S08_SC_B]
connect_bd_intf_net [get_bd_intf_pins m08_nodes/M_SC_AR] [get_bd_intf_pins m08_sc2axi/S_SC_AR]
connect_bd_intf_net [get_bd_intf_pins m08_nodes/M_SC_AW] [get_bd_intf_pins m08_sc2axi/S_SC_AW]
connect_bd_intf_net [get_bd_intf_pins m08_nodes/M_SC_W] [get_bd_intf_pins m08_sc2axi/S_SC_W]
connect_bd_intf_net [get_bd_intf_pins m08_nodes/S_SC_R] [get_bd_intf_pins m08_sc2axi/M_SC_R]
connect_bd_intf_net [get_bd_intf_pins m08_nodes/S_SC_B] [get_bd_intf_pins m08_sc2axi/M_SC_B]
connect_bd_intf_net [get_bd_intf_pins s00_nodes/S_SC_B] [get_bd_intf_pins switchboards/M00_SC_B]
connect_bd_intf_net [get_bd_intf_pins s00_nodes/M_SC_W] [get_bd_intf_pins switchboards/S00_SC_W]
connect_bd_intf_net [get_bd_intf_pins s00_nodes/M_SC_AR] [get_bd_intf_pins switchboards/S00_SC_AR]
connect_bd_intf_net [get_bd_intf_pins s00_nodes/S_SC_R] [get_bd_intf_pins switchboards/M00_SC_R]
connect_bd_intf_net [get_bd_intf_pins s00_nodes/M_SC_AW] [get_bd_intf_pins switchboards/S00_SC_AW]
connect_bd_intf_net [get_bd_intf_pins s00_nodes/M_SC_B] [get_bd_intf_pins s00_axi2sc/S_SC_B]
connect_bd_intf_net [get_bd_intf_pins s00_nodes/S_SC_W] [get_bd_intf_pins s00_axi2sc/M_SC_W]
connect_bd_intf_net [get_bd_intf_pins s00_nodes/M_SC_R] [get_bd_intf_pins s00_axi2sc/S_SC_R]
connect_bd_intf_net [get_bd_intf_pins s00_nodes/S_SC_AW] [get_bd_intf_pins s00_axi2sc/M_SC_AW]
connect_bd_intf_net [get_bd_intf_pins s00_nodes/S_SC_AR] [get_bd_intf_pins s00_axi2sc/M_SC_AR]
connect_bd_intf_net [get_bd_intf_ports S00_AXI] [get_bd_intf_pins s00_entry_pipeline/s_axi]
connect_bd_intf_net [get_bd_intf_pins s00_entry_pipeline/m_axi] [get_bd_intf_pins s00_axi2sc/S_AXI]
connect_bd_intf_net [get_bd_intf_pins m05_nodes/S_SC_R] [get_bd_intf_pins m05_sc2axi/M_SC_R]
connect_bd_intf_net [get_bd_intf_pins m05_nodes/M_SC_W] [get_bd_intf_pins m05_sc2axi/S_SC_W]
connect_bd_intf_net [get_bd_intf_pins m05_nodes/S_SC_B] [get_bd_intf_pins m05_sc2axi/M_SC_B]
connect_bd_intf_net [get_bd_intf_pins m05_nodes/M_SC_AR] [get_bd_intf_pins m05_sc2axi/S_SC_AR]
connect_bd_intf_net [get_bd_intf_pins m05_nodes/S_SC_AW] [get_bd_intf_pins switchboards/M05_SC_AW]
connect_bd_intf_net [get_bd_intf_pins m05_nodes/S_SC_W] [get_bd_intf_pins switchboards/M05_SC_W]
connect_bd_intf_net [get_bd_intf_pins m05_nodes/M_SC_R] [get_bd_intf_pins switchboards/S05_SC_R]
connect_bd_intf_net [get_bd_intf_pins m05_sc2axi/M_AXI] [get_bd_intf_pins m05_exit_pipeline/s_axi]
connect_bd_intf_net [get_bd_intf_pins m05_nodes/S_SC_AR] [get_bd_intf_pins switchboards/M05_SC_AR]
connect_bd_intf_net [get_bd_intf_pins m05_nodes/M_SC_B] [get_bd_intf_pins switchboards/S05_SC_B]
connect_bd_intf_net [get_bd_intf_pins m05_nodes/M_SC_AW] [get_bd_intf_pins m05_sc2axi/S_SC_AW]
connect_bd_intf_net [get_bd_intf_ports M09_AXI] [get_bd_intf_pins m09_exit_pipeline/m_axi]
connect_bd_intf_net [get_bd_intf_pins m02_nodes/S_SC_B] [get_bd_intf_pins m02_sc2axi/M_SC_B]
connect_bd_intf_net [get_bd_intf_pins m02_nodes/S_SC_R] [get_bd_intf_pins m02_sc2axi/M_SC_R]
connect_bd_intf_net [get_bd_intf_pins m02_nodes/M_SC_W] [get_bd_intf_pins m02_sc2axi/S_SC_W]
connect_bd_intf_net [get_bd_intf_pins m02_nodes/M_SC_AW] [get_bd_intf_pins m02_sc2axi/S_SC_AW]
connect_bd_intf_net [get_bd_intf_pins m02_nodes/M_SC_AR] [get_bd_intf_pins m02_sc2axi/S_SC_AR]
connect_bd_intf_net [get_bd_intf_pins m06_nodes/S_SC_AW] [get_bd_intf_pins switchboards/M06_SC_AW]
connect_bd_intf_net [get_bd_intf_pins m06_nodes/S_SC_W] [get_bd_intf_pins switchboards/M06_SC_W]
connect_bd_intf_net [get_bd_intf_ports M06_AXI] [get_bd_intf_pins m06_exit_pipeline/m_axi]
connect_bd_intf_net [get_bd_intf_pins m06_nodes/M_SC_W] [get_bd_intf_pins m06_sc2axi/S_SC_W]
connect_bd_intf_net [get_bd_intf_pins m06_nodes/S_SC_R] [get_bd_intf_pins m06_sc2axi/M_SC_R]
connect_bd_intf_net [get_bd_intf_pins m06_nodes/S_SC_B] [get_bd_intf_pins m06_sc2axi/M_SC_B]
connect_bd_intf_net [get_bd_intf_pins m06_nodes/M_SC_R] [get_bd_intf_pins switchboards/S06_SC_R]
connect_bd_intf_net [get_bd_intf_pins m06_nodes/S_SC_AR] [get_bd_intf_pins switchboards/M06_SC_AR]
connect_bd_intf_net [get_bd_intf_pins m06_sc2axi/M_AXI] [get_bd_intf_pins m06_exit_pipeline/s_axi]
connect_bd_intf_net [get_bd_intf_pins m06_nodes/M_SC_AW] [get_bd_intf_pins m06_sc2axi/S_SC_AW]
connect_bd_intf_net [get_bd_intf_pins m06_nodes/M_SC_AR] [get_bd_intf_pins m06_sc2axi/S_SC_AR]
connect_bd_intf_net [get_bd_intf_pins m06_nodes/M_SC_B] [get_bd_intf_pins switchboards/S06_SC_B]
connect_bd_intf_net [get_bd_intf_pins m09_sc2axi/M_AXI] [get_bd_intf_pins m09_exit_pipeline/s_axi]
connect_bd_intf_net [get_bd_intf_pins m09_nodes/S_SC_AR] [get_bd_intf_pins switchboards/M09_SC_AR]
connect_bd_intf_net [get_bd_intf_pins m09_nodes/S_SC_AW] [get_bd_intf_pins switchboards/M09_SC_AW]
connect_bd_intf_net [get_bd_intf_pins m09_nodes/S_SC_W] [get_bd_intf_pins switchboards/M09_SC_W]
connect_bd_intf_net [get_bd_intf_pins m09_nodes/M_SC_R] [get_bd_intf_pins switchboards/S09_SC_R]
connect_bd_intf_net [get_bd_intf_pins m09_nodes/M_SC_B] [get_bd_intf_pins switchboards/S09_SC_B]
connect_bd_intf_net [get_bd_intf_pins m09_nodes/M_SC_AR] [get_bd_intf_pins m09_sc2axi/S_SC_AR]
connect_bd_intf_net [get_bd_intf_pins m09_nodes/M_SC_AW] [get_bd_intf_pins m09_sc2axi/S_SC_AW]
connect_bd_intf_net [get_bd_intf_pins m09_nodes/M_SC_W] [get_bd_intf_pins m09_sc2axi/S_SC_W]
connect_bd_intf_net [get_bd_intf_pins m09_nodes/S_SC_R] [get_bd_intf_pins m09_sc2axi/M_SC_R]
connect_bd_intf_net [get_bd_intf_pins m09_nodes/S_SC_B] [get_bd_intf_pins m09_sc2axi/M_SC_B]
connect_bd_intf_net [get_bd_intf_pins m02_sc2axi/M_AXI] [get_bd_intf_pins m02_exit_pipeline/s_axi]
connect_bd_intf_net [get_bd_intf_pins m02_nodes/S_SC_AR] [get_bd_intf_pins switchboards/M02_SC_AR]
connect_bd_intf_net [get_bd_intf_pins m02_nodes/S_SC_AW] [get_bd_intf_pins switchboards/M02_SC_AW]
connect_bd_intf_net [get_bd_intf_pins m02_nodes/S_SC_W] [get_bd_intf_pins switchboards/M02_SC_W]
connect_bd_intf_net [get_bd_intf_pins m02_nodes/M_SC_R] [get_bd_intf_pins switchboards/S02_SC_R]
connect_bd_intf_net [get_bd_intf_pins m02_nodes/M_SC_B] [get_bd_intf_pins switchboards/S02_SC_B]
connect_bd_intf_net [get_bd_intf_ports M05_AXI] [get_bd_intf_pins m05_exit_pipeline/m_axi]
connect_bd_intf_net [get_bd_intf_ports M10_AXI] [get_bd_intf_pins m10_exit_pipeline/m_axi]
connect_bd_intf_net [get_bd_intf_pins m10_sc2axi/M_AXI] [get_bd_intf_pins m10_exit_pipeline/s_axi]
